# Altium schematic sheet SVT12100VB_R2_000011_SVT12100VB_R2_00001.schdoc
size 124 x 99 mm
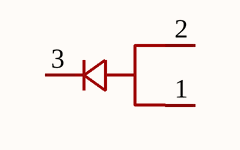
[diagram p0: SVT12100VB_R2_000011_SVT12100VB_R2_00001.schdoc]

## Parts
D?  SVT12100VB_R2_00001  [TO-277B_3P-L6.1-W4.3-LS7.0-BR]  (value not drawn)

## Nets

Not connected (* = marked no-connect by the designer): D? 1 2 3

## Library data of the parts
D? = SVT12100VB_R2_00001: Manufacturer: PANJIT(强茂); Add into BOM: yes; Forward Voltage (Vf@If): 670mV@12A; Reverse Voltage (Vr): 100V; Average Rectified Current (Io): 12A; Reverse Leakage Current (Ir): 100uA@100V; Symbol: SVT12100VB_R2_00001; Device: SVT12100VB_R2_00001; LCSC Part Name: 电压:100V 电流:12A; Supplier Part: C391735; Manufacturer Part: SVT12100VB_R2_00001; Supplier Footprint: TO-277B; JLCPCB Part Class: Extended Part; Datasheet: https://atta.szlcsc.com/upload/public/pdf/source/20191009/C391735_74715AF6864FC3D0E0C927F6D6BDC70E.pdf; Supplier: LCSC; Convert to PCB: yes